# EasyEDA Pro project 2Axis-5.0-南塘 - (0522).eprj, schematic 2轴南塘

## Sheets
1 2轴南塘: Board Name: 2轴南塘; Create Date: 2025-03-24; Page Name: 2轴南塘; Project Name: 2Axis-5.0-南塘 - (0522); Schematic Name: 2轴南塘; Update Date: 2025-05-22; Address1: *; Address2: *; Address3: *; Address4: *; Application_BuildNumber: *; ApprovedBy: *; Author: *; CheckedBy: *; CompanyName: *; CurrentDate: *; CurrentTime: *; Date: *; DocumentFullPathAndName: *; DocumentName: *; DocumentNumber: *; DrawnBy: *; Engineer: *; ImagePath: *; ModifiedDate: *; Organization: *; ProjectName: *; Revision: *; Rule: *; SheetNumber: *; SheetTotal: *; Time: *; Title: *
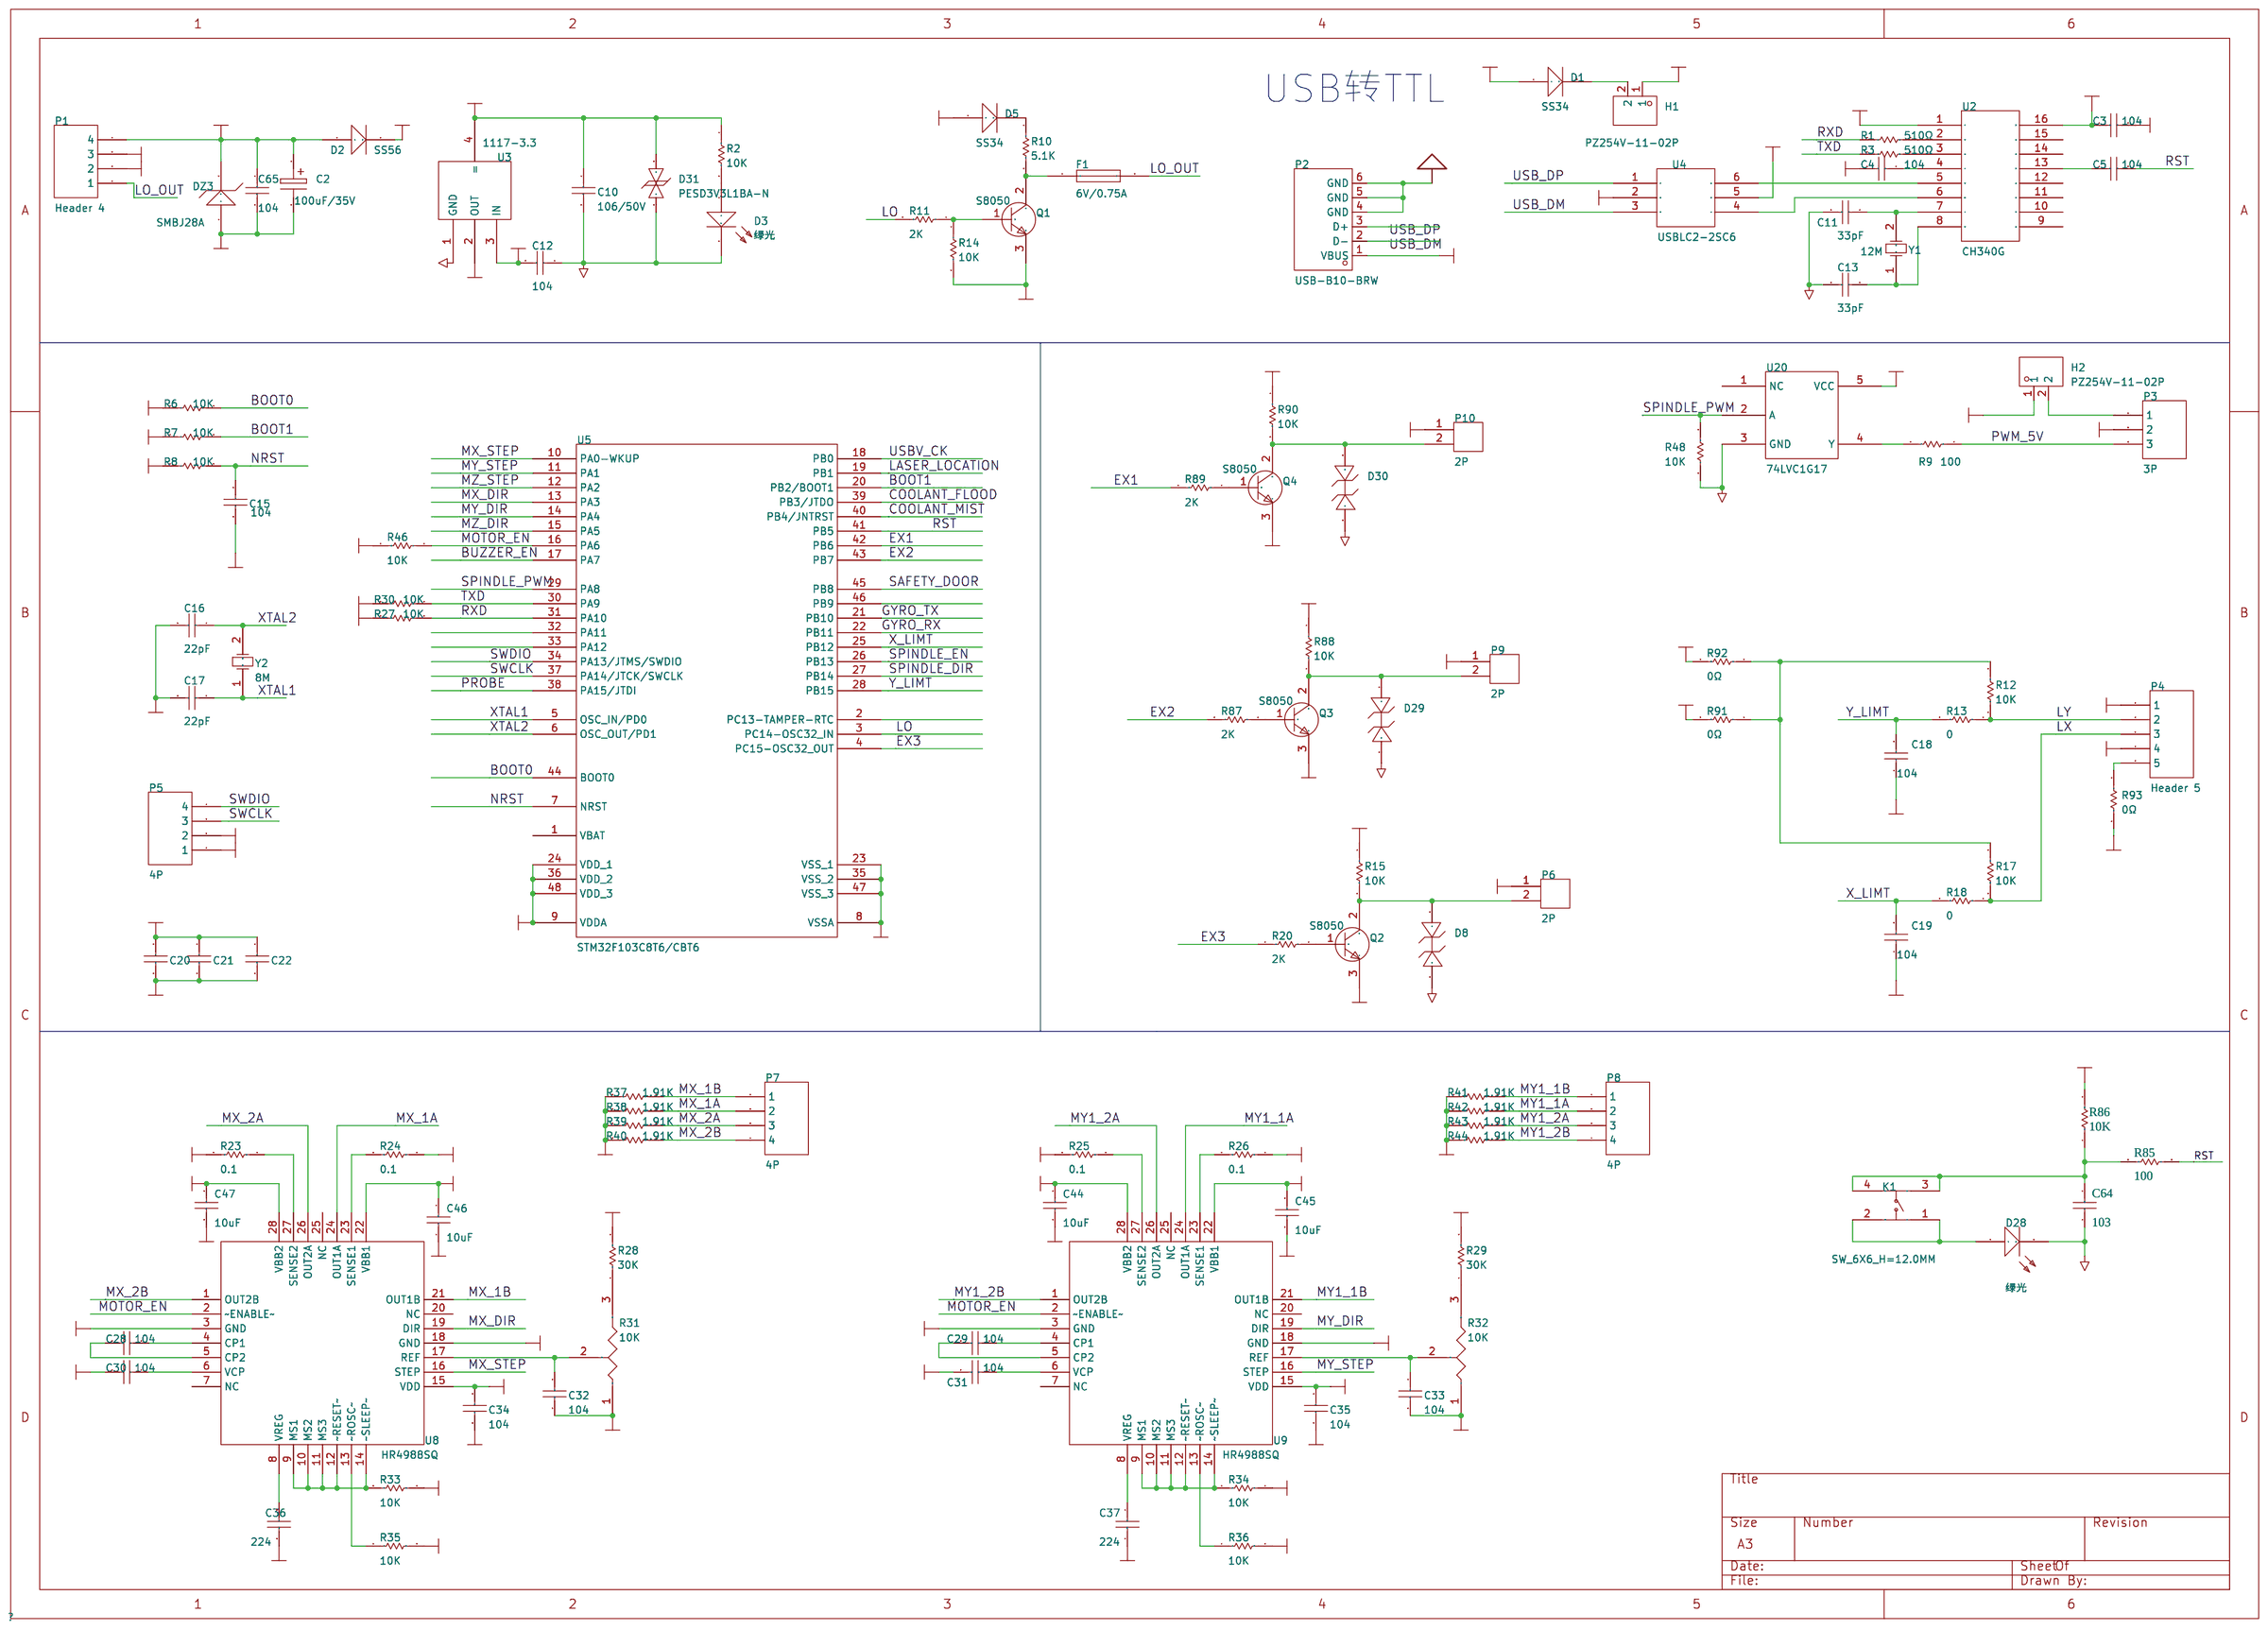
[diagram p0: 2轴南塘]
2 电源: Create Date: 2025-04-17; Page Name: 电源; Project Name: 2Axis-5.0-南塘; Update Date: 2025-05-21
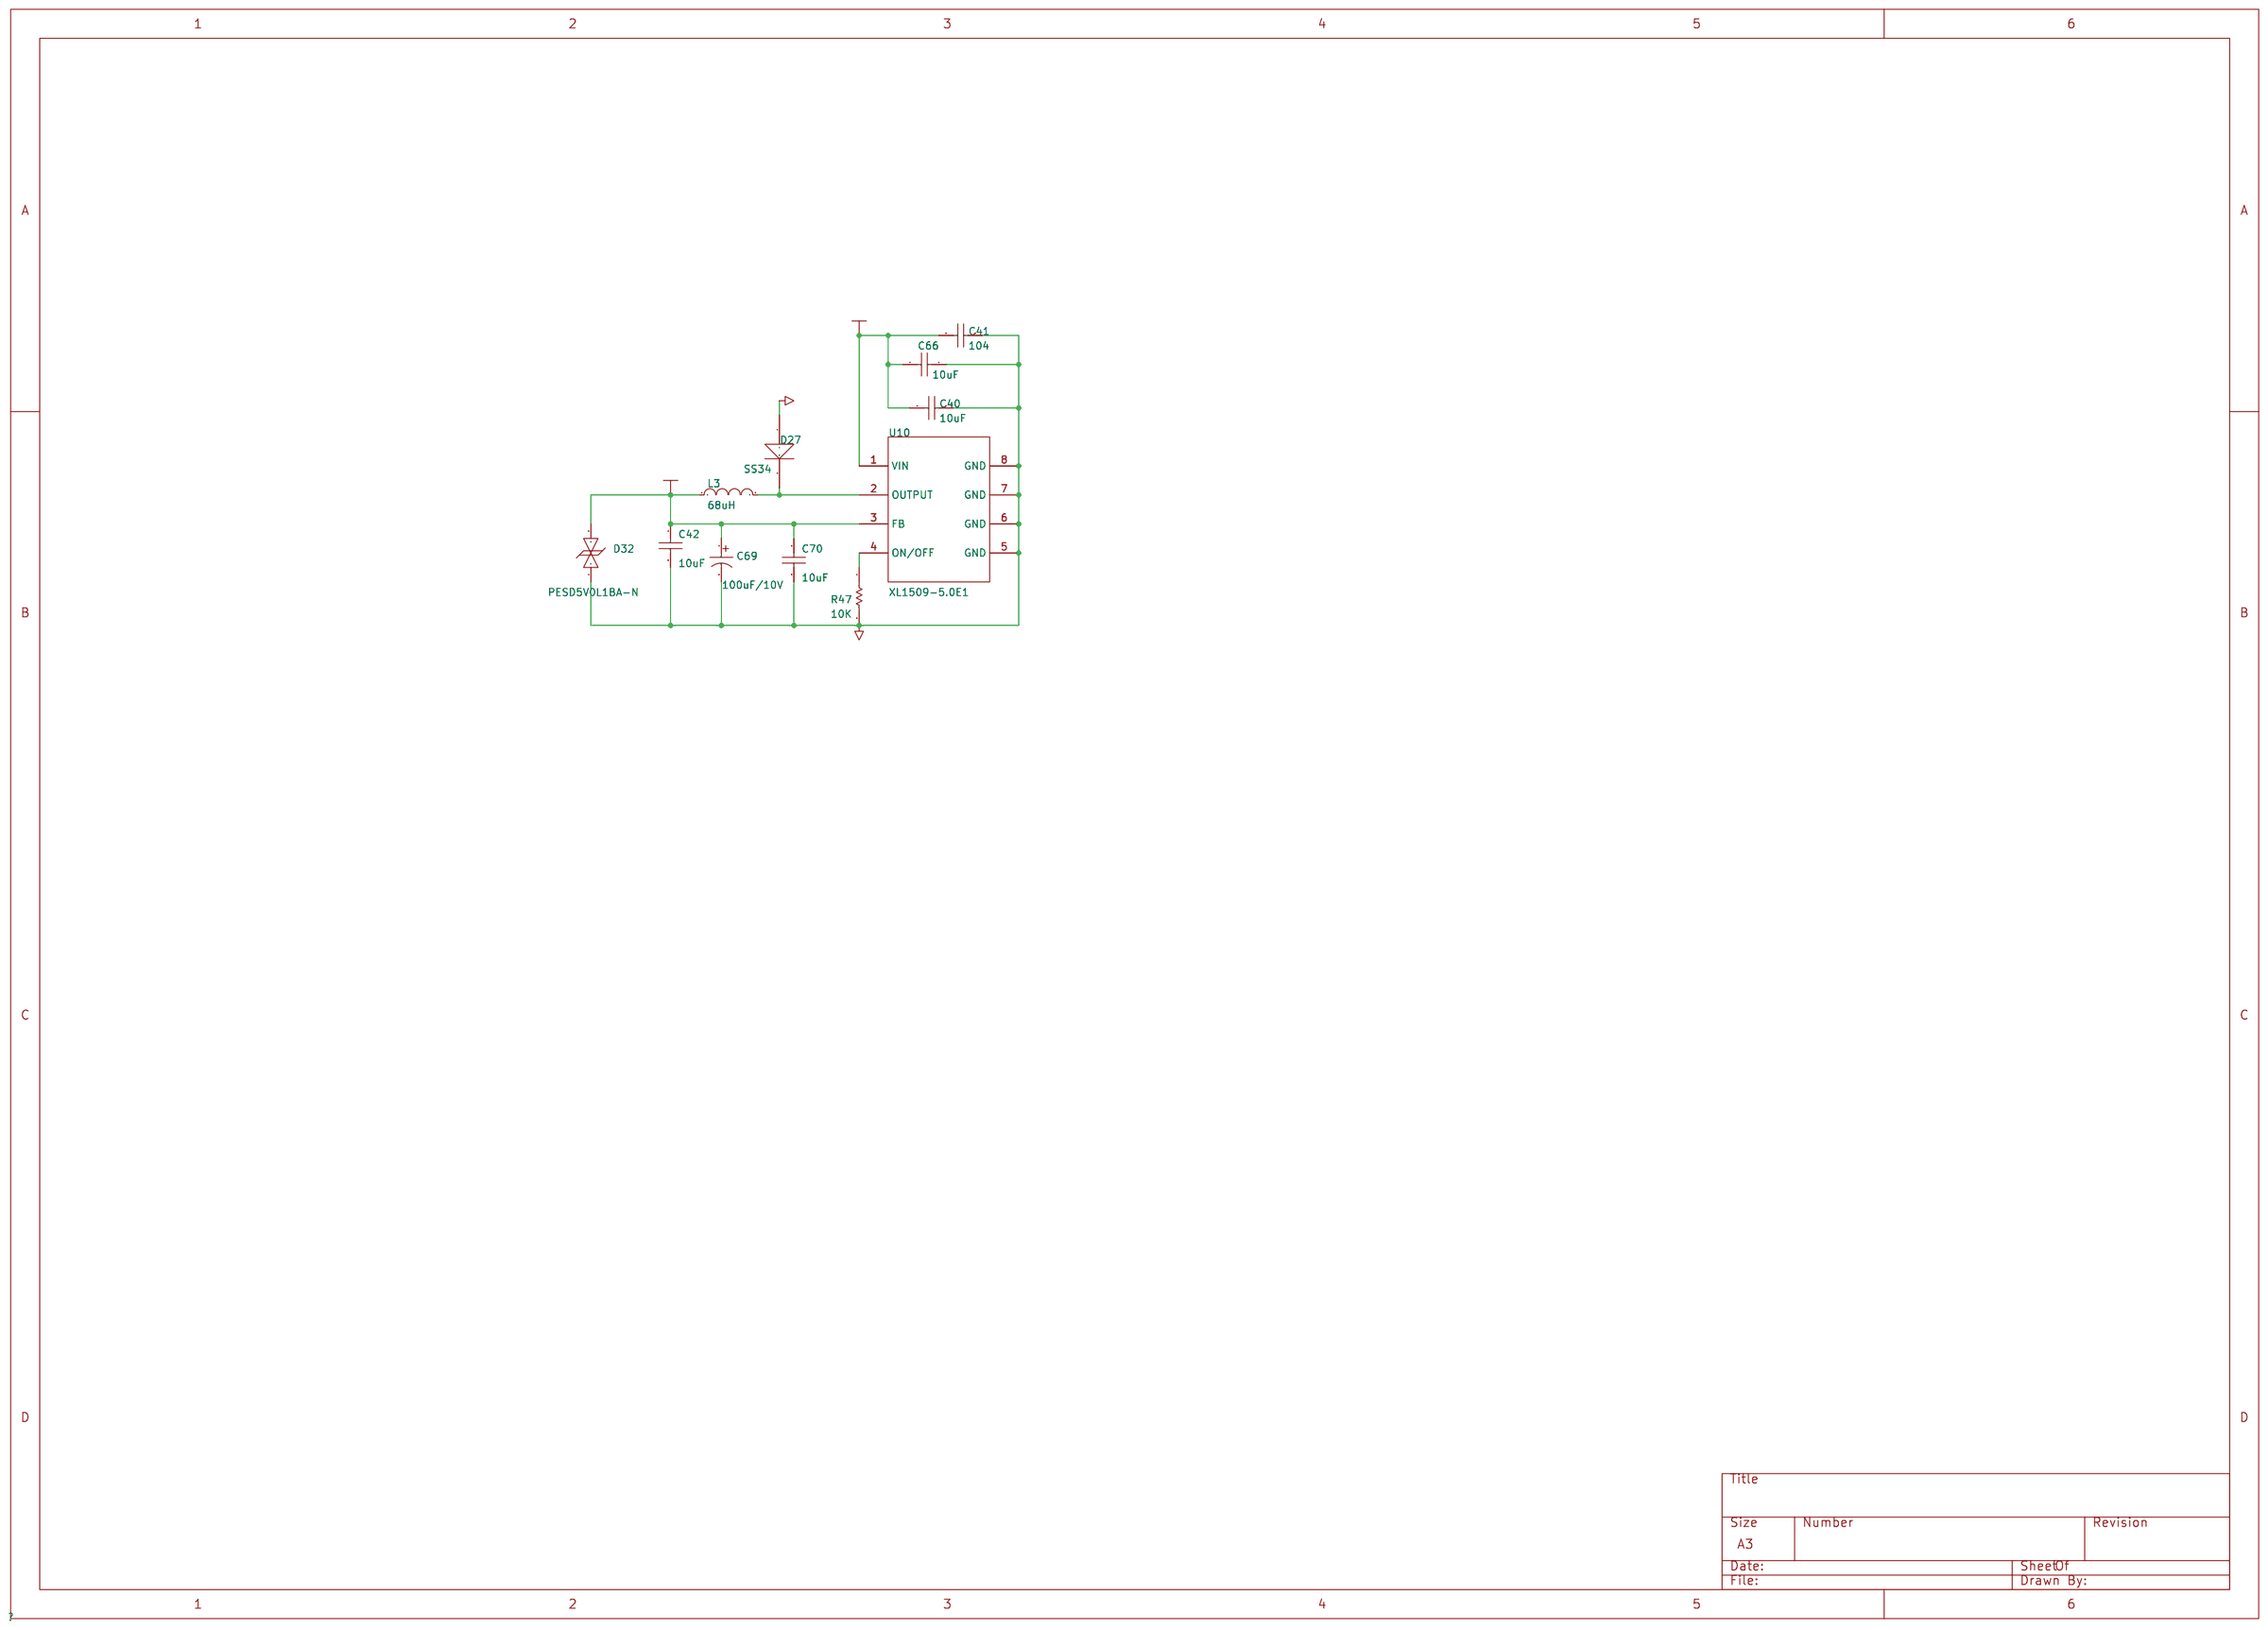
[diagram p1: 电源]

## Parts
sheet 2轴南塘
C2  100uF/35V  [电解电容贴片6X6]
C3  104  [0603C]
C4  104  [0603C]
C5  104  [0603C]
C10  106/50V  [1206C]
C11  18pF  [0603C]
C12  104  [0603C]
C13  18pF  [0603C]
C15  104  [0603C]
C16  100pF  [0603C]
C17  100pF  [0603C]
C18  104  [0603C]
C19  104  [0603C]
C20  104  [0603C]
C21  104  [0603C]
C22  104  [0603C]
C28  104  [0603C]
C29  104  [0603C]
C30  104  [0603C]
C31  104  [0603C]
C32  104  [0603C]
C33  104  [0603C]
C34  104  [0603C]
C35  104  [0603C]
C36  224  [0603C]
C37  224  [0603C]
C44  10uF  [C1206]
C45  10uF  [C1206]
C46  10uF  [C1206]
C47  10uF  [C1206]
C64  103  [0603C]
C65  104  [0603C]
D1  SS34  [SMA]
D2  SS56  [SMA]
D3  绿光  [0603LED]
D5  SS34  [SMA]
D8  ESD05V52D-C  [SOD-523_L1.2-W0.8-LS1.6-BI]
D28  绿光  [0603LED]
D29  ESD05V52D-C  [SOD-523_L1.2-W0.8-LS1.6-BI]
D30  ESD05V52D-C  [SOD-523_L1.2-W0.8-LS1.6-BI]
D31  PESD3V3L1BA-N  [SOD-323_L1.8-W1.3-LS2.5-BI]
DZ3  SMBJ28A  [SMB]
F1  6V/0.75A  [1206R]
H1  PZ254V-11-02P  [HDR-TH_2P-P2.54-V-M]
H2  PZ254V-11-02P  [HDR-TH_2P-P2.54-V-M]
K1  SW_6X6_H=12.0MM  [KEY-SMD_4P-L6.0-W6.0-P4.50-LS9.0]
P1  Header 4  [VH3.96-4P直插座]
P2  USB-B10-BRW  [USB-B-TH_USB-B10-BRW]
P3  3P  [HDR1X3_CON]
P4  Header 5  [HDR1X5_CON]
P5  4P  [SIP4]
P6  2P  [HDR1X2_CON]
P7  4P  [HDR1X4_CON]
P8  4P  [HDR1X4_CON]
P9  2P  [HDR1X2_CON]
P10  2P  [HDR1X2_CON]
Q1  S8050  [SOT-23]
Q2  S8050  [SOT-23]
Q3  S8050  [SOT-23]
Q4  S8050  [SOT-23]
R1  510Ω  [0603R]
R2  10K  [0603R]
R3  510Ω  [0603R]
R6  10K  [0603R]
R7  10K  [0603R]
R8  10K  [0603R]
R9  100  [0603R]
R10  5.1K  [0603R]
R11  2K  [0603R]
R12  10K  [0603R]
R13  0  [0603R]
R14  10K  [0603R]
R15  10K  [0603R]
R17  10K  [0603R]
R18  0  [0603R]
R20  2K  [0603R]
R23  0.1  [1206R]
R24  0.1  [1206R]
R25  0.1  [1206R]
R26  0.1  [1206R]
R27  10K  [0603R]
R28  10K  [0603R]
R29  10K  [0603R]
R30  10K  [0603R]
R31  10K  [松下贴片电位器3x3]
R32  10K  [松下贴片电位器3x3]
R33  10K  [0603R]
R34  10K  [0603R]
R35  10K  [0603R]
R36  10K  [0603R]
R37  1.91K  [1206R]
R38  1.91K  [1206R]
R39  1.91K  [1206R]
R40  1.91K  [1206R]
R41  1.91K  [1206R]
R42  1.91K  [1206R]
R43  1.91K  [1206R]
R44  1.91K  [1206R]
R46  10K  [0603R]
R48  10K  [0603R]
R85  100  [0603R]
R86  10K  [0603R]
R87  2K  [0603R]
R88  10K  [0603R]
R89  2K  [0603R]
R90  10K  [0603R]
R91  0Ω  [0603R]
R92  0Ω  [0603R]
R93  0Ω  [0603R]
U2  CH340G  [SOP16]
U3  1117-3.3  [SOT-223]
U4  USBLC2-2SC6  [SOT-23-6]
U5  STM32F103C8T6/CBT6  [LQFP48]
U8  HR4988SQ  [QFN28]
U9  HR4988SQ  [QFN28]
U20  74LVC1G17  [SOT-23-5]
Y1  12M  [晶振贴片49SSMD]
Y2  8M  [晶振贴片]
sheet 电源
C40  10uF  [C1206]
C41  104  [0603C]
C42  10uF  [C1206]
C66  10uF  [C1206]
C69  100uF/10V  [CAP-SMD_BD5.0-L5.3-W5.3-RD]
C70  10uF  [C1206]
D27  SS34  [SMA]
D32  PESD5V0L1BA-N  [SOD-323_L1.8-W1.3-LS2.5-BI]
L3  68uH  [IND-SMD_L7.0-W7.0_SMDRI74-330MT]
R47  10K  [0603R]
U10  XL1509-5.0E1  [ESOP-8_L4.9-W3.9-P1.27-LS6.0-BL-EP]

## Library data of the parts
C2 = 100uF/35V: Origin Footprint 2: X47U; Origin Footprint 1: 电解电容贴片6x6; Design Item ID: ELECTRO1; Library Name: *
C3-C5 C12 C15 C41 C65 = 104: Capacitor (Semiconductor SIM Model); Published: 8-Jun-2000; LatestRevisionDate: 17-Jul-2002; LatestRevisionNote: Re-released for DXP Platform.; PackageReference: C1206; Publisher: Altium Limited; Origin Footprint 2: C1206; Origin Footprint 3: 0402; Origin Footprint 4: 1310[0504]; Origin Footprint 5: 1608[0603]; Origin Footprint 6: C1210; Origin Footprint 7: C0805; Origin Footprint 8: C1206; Origin Footprint 9: 0805; Origin Footprint 10: 0805L; Origin Footprint 11: 0805C; Design Item ID: Cap Semi; Library Name: Miscellaneous Devices
C10 = 106/50V: Capacitor (Semiconductor SIM Model); Published: 8-Jun-2000; LatestRevisionDate: 17-Jul-2002; LatestRevisionNote: Re-released for DXP Platform.; PackageReference: C1206; Publisher: Altium Limited; Origin Footprint 2: C1206; Origin Footprint 3: 0402; Origin Footprint 4: 1310[0504]; Origin Footprint 5: 1608[0603]; Origin Footprint 6: C1210; Origin Footprint 7: C0805; Origin Footprint 8: C1206; Origin Footprint 9: 0805; Origin Footprint 10: 0805L; Design Item ID: Cap Semi; Library Name: Miscellaneous Devices
C11 C13 = 33pF: Capacitor (Semiconductor SIM Model); Published: 8-Jun-2000; LatestRevisionDate: 17-Jul-2002; LatestRevisionNote: Re-released for DXP Platform.; PackageReference: C1206; Publisher: Altium Limited; Origin Footprint 2: C1206; Origin Footprint 3: 0402; Origin Footprint 4: 1310[0504]; Origin Footprint 5: 1608[0603]; Origin Footprint 6: C1210; Origin Footprint 7: C0805; Origin Footprint 8: C1206; Origin Footprint 9: 0805; Origin Footprint 10: 0805L; Design Item ID: Cap Semi; Library Name: Miscellaneous Devices
C16 C17 = 22pF: Capacitor (Semiconductor SIM Model); Published: 8-Jun-2000; LatestRevisionDate: 17-Jul-2002; LatestRevisionNote: Re-released for DXP Platform.; PackageReference: C1206; Publisher: Altium Limited; Origin Footprint 2: C1206; Origin Footprint 3: 0402; Origin Footprint 4: 1310[0504]; Origin Footprint 5: 1608[0603]; Origin Footprint 6: C1210; Origin Footprint 7: C0805; Origin Footprint 8: C1206; Origin Footprint 9: 0805; Origin Footprint 10: 0805L; Origin Footprint 11: 0805C; Design Item ID: Cap Semi; Library Name: Miscellaneous Devices
C18-C22 C28-C35 = 104: Origin Footprint 2: CAP; Origin Footprint 3: 0805C; Design Item ID: CAP; Library Name: SCH封装库
C36 C37 = 224: Design Item ID: CAP; Library Name: SCH封装库
C40 C42 C44-C47 C66 C70 = 104: Design Item ID: CAP; Library Name: SCH--װ--
C64 = 103: Design Item ID: CAP; Library Name: SCH--װ--
D1 D2 D5 = SS56: Design Item ID: 1N4148; Library Name: SCH封装库
D3 D28 = 红光: Origin Footprint 2: LED(小); Design Item ID: LED; Library Name: SCH封装库
D8 D29 D30 = ESD05V52D-C: 极性：双向 反向截止电压(Vrwm)：5V 击穿电压(VBR)：5.6V 钳位电压(Vc)@Ipp：15V 反向截止电压(Vrwm)：5V 击穿电压(最小值)：5.6V 峰值脉冲电流(Ipp)@tp=8/20μs：5A 最大钳位电压：15V; Supplier Part: C727170; Manufacturer: TWGMC(台湾迪嘉); Supplier Footprint: SOD-523; JLCPCB Part Class: 扩展库; Datasheet: https://atta.szlcsc.com/upload/public/pdf/source/20200827/C727170_700AFDE065FF081A69A0C04747B3686A.pdf; Supplier: LCSC
D31 D32 = PESD5V0S1BBN: 极性:Bidirectional;反向关断电压（典型值）:5V (Max);击穿电压（最小值）:6V;箝位电压:15V;峰值脉冲电流（10/1000us）:5A (8/20us);; Supplier Part: C314264; Manufacturer: BORN伯恩半导体; Supplier Footprint: SOD-523; JLCPCB Part Class: Extended Part; Datasheet: https://atta.szlcsc.com/upload/public/pdf/source/20181015/C314264_F9AC5761AC2631DA841FBD1D9C6821E3.pdf; Supplier: LCSC; Polarity: Bidirectional; Voltage - Reverse Standoff (Typ): 5V (Max); Voltage - Breakdown (Min): 6V; Voltage - Clamping (Max) @ Ipp: 15V; Current - Peak Pulse (10/1000μs): 5A (8/20us)
DZ3 = SMBJ28A: Design Item ID: 稳压二极管; Library Name: SCH封装库
F1 = 6V/0.75A: 保险丝; Design Item ID: FUSE1; Library Name: SCH封装库
H1 H2 = PZ254V-11-02P: 插针结构:1x2P;间距:2.54mm;行距:-;圆针/方针:方针;安装类型:直插;排数:单排;总PIN位数:2P;额定电流:-;额定电压:-;配合针长度:6mm;塑高:2.5mm;端接针长度:3mm;触头材质:黄铜;触头镀层:-;工作温度范围:-40℃~+105℃;颜色:黑色;; LCSC Part Name: 间距:2.54mm 1x2P 直插 方针; Supplier Part: C492401; Manufacturer: XFCN(兴飞); Supplier Footprint: 插件,P=2.54mm; JLCPCB Part Class: 扩展库; Datasheet: https://atta.szlcsc.com/upload/public/pdf/source/20200309/C492401_A812433581A9B211A7FFA413ADDFF0E5.pdf; Supplier: LCSC; Pin Structure: 1x2P; Pitch: 2.54mm; Circluar Pins/Square Pins: 方针; Mounting Type: 直插; Number of Rows: 单排; Number of Pins: 2P; Length of Mating Pin: 6mm; Insulation Height: 2.5mm; Length of End Connection Pin: 3mm; Contact Material: 黄铜; Operating Temperature Range: -40℃~+105℃; Color: 黑色
K1 = SW_6X6_H=12.0MM: Supplier Part: C9900018802; Supplier Footprint: KEY-SMD; JLCPCB Part Class: 扩展库; Supplier: LCSC
P1 = Header 4: Header, 4-Pin; LatestRevisionDate: 17-Jul-2002; LatestRevisionNote: Re-released for DXP Platform.; Publisher: Altium Limited; Library Name: Miscellaneous Connectors
P2 = USB-B10-BRW: 连接器类型:Type-B;标准:USB 2.0;公母:母;端口数量:1;触点数量:4P;安装方式:弯插;额定电流 - 电源:1.5A;工作温度范围:-20℃~+70℃;焊接温度(最大值):260℃;; LCSC Part Name: Type-B母弯插; Supplier Part: C720549; Manufacturer: XUNPU(讯普); Supplier Footprint: 插件; JLCPCB Part Class: 扩展库; Datasheet: https://atta.szlcsc.com/upload/public/pdf/source/20200812/C720549_53E9294752E2933874870440E626C579.pdf; Supplier: LCSC; Connector Type: Type-B; Standard: USB2.0; Gender: 母; Number of Ports: 1; Number of Contacts: 4P; Mounting Style: 弯插; Current Rating - Power (Max): 1.5A; Operating Temperature Range: -20℃~+70℃; Soldering Temperature(Max): 260℃
P3 = 3P: Library Name: SCH封装库
P4 = Header 5: Header, 5-Pin; LatestRevisionDate: 17-Jul-2002; LatestRevisionNote: Re-released for DXP Platform.; Publisher: Altium Limited; Library Name: Miscellaneous Connectors
P5 P7 P8 = 4P: Library Name: SCH封装库
P6 P9 P10 = 2P: Library Name: SCH封装库
Q1-Q4 = S8050: Published: 8-Jun-2000; LatestRevisionDate: 17-Jul-2002; LatestRevisionNote: Re-released for DXP Platform.; PackageReference: TO-226; Publisher: Altium Limited; Code_JEDEC: TO-226-AA; Origin Footprint 2: TO-92; Design Item ID: NPN; Library Name: SCH封装库
R1 R3 R9 R15 R88 R90 = 100: Resistor; Published: 8-Jun-2000; LatestRevisionDate: 17-Jul-2002; LatestRevisionNote: Re-released for DXP Platform.; PackageReference: AXIAL-0.3; Publisher: Altium Limited; Origin Footprint 2: AXIAL-0.3; Origin Footprint 3: R0805; Origin Footprint 4: 0805R; Design Item ID: RES; Library Name: SCH封装库
R2 R10 R11 R13 R18 R20 R87 R89 R91-R93 = 2K: Resistor; Published: 8-Jun-2000; LatestRevisionDate: 17-Jul-2002; LatestRevisionNote: Re-released for DXP Platform.; PackageReference: AXIAL-0.3; Publisher: Altium Limited; Origin Footprint 2: AXIAL-0.3; Origin Footprint 3: R0805; Origin Footprint 4: 0805R; Design Item ID: RES; Library Name: SCH封装库
R6-R8 R27 R30 = 10k: Resistor; Published: 8-Jun-2000; LatestRevisionDate: 17-Jul-2002; LatestRevisionNote: Re-released for DXP Platform.; PackageReference: AXIAL-0.3; Publisher: Altium Limited; Origin Footprint 2: AXIAL-0.3; Origin Footprint 3: 0805R; Origin Footprint 4: 0805R; Design Item ID: RES; Library Name: SCH封装库
R12 R14 R17 R28 R29 R33 R34 R46 R47 = 10k: Resistor; Published: 8-Jun-2000; LatestRevisionDate: 17-Jul-2002; LatestRevisionNote: Re-released for DXP Platform.; PackageReference: AXIAL-0.3; Publisher: Altium Limited; Origin Footprint 2: AXIAL-0.3; Origin Footprint 3: R0805; Origin Footprint 4: 0805R; Design Item ID: RES; Library Name: SCH封装库
R23-R26 = 0.1: Resistor; Published: 8-Jun-2000; LatestRevisionDate: 17-Jul-2002; LatestRevisionNote: Re-released for DXP Platform.; PackageReference: AXIAL-0.3; Publisher: Altium Limited; Origin Footprint 2: AXIAL-0.3; Origin Footprint 3: R0805; Origin Footprint 4: 0603R; Design Item ID: RES; Library Name: SCH封装库
R31 R32 = 10K: Design Item ID: 电位器; Library Name: SCH封装库
R35 R36 = 10k: Resistor; Published: 8-Jun-2000; LatestRevisionDate: 17-Jul-2002; LatestRevisionNote: Re-released for DXP Platform.; PackageReference: AXIAL-0.3; Publisher: Altium Limited; Origin Footprint 2: AXIAL-0.3; Origin Footprint 3: R0805; Design Item ID: RES; Library Name: SCH封装库
R37-R44 = 1.91K: Resistor; Published: 8-Jun-2000; LatestRevisionDate: 17-Jul-2002; LatestRevisionNote: Re-released for DXP Platform.; PackageReference: AXIAL-0.3; Publisher: Altium Limited; Origin Footprint 2: AXIAL-0.3; Origin Footprint 3: R0805; Origin Footprint 4: 0805R; Design Item ID: RES; Library Name: SCH封装库
R48 R86 = 10K: Resistor; Published: 8-Jun-2000; LatestRevisionDate: 17-Jul-2002; LatestRevisionNote: Re-released for DXP Platform.; PackageReference: AXIAL-0.3; Publisher: Altium Limited; Origin Footprint 2: AXIAL-0.3; Origin Footprint 3: R0805; Origin Footprint 4: 0805R; Design Item ID: RES; Library Name: SCH--װ--
R85 = 100: Resistor; Published: 8-Jun-2000; LatestRevisionDate: 17-Jul-2002; LatestRevisionNote: Re-released for DXP Platform.; PackageReference: AXIAL-0.3; Publisher: Altium Limited; Origin Footprint 2: AXIAL-0.3; Origin Footprint 3: R0805; Origin Footprint 4: 0805R; Design Item ID: RES; Library Name: SCH--װ--
U2 = CH340G: Design Item ID: DIP16; Library Name: SCH封装库
U3 = 1117-3.3: Design Item ID: LM1117; Library Name: Party600
U4 = USBLC2-2SC6: Design Item ID: DIP6; Library Name: SCH封装库
U5 = STM32F103C8T6/CBT6: STM32 ARM-based 32-bit MCU with 32 Kbytes Flash, 48-pin LQFP, Industrial Temperature; Published: *; DatasheetVersion: *; PackageVersion: *; PackageReference: *; Publisher: *; PackageDescription: *; ComponentLink1Description: *; ComponentLink1URL: *; ComponentLink2Description: *; ComponentLink2URL: *; Origin Footprint 2: LQFP48_L; Origin Footprint 3: LQFP48_M; Design Item ID: STM32F103C6T6; Library Name: ST Microcontroller 32-Bit STM32 SCH
U8 U9 = HR4988SQ: Design Item ID: HR4988; Library Name: SCH封装库
U20 = 74LVC1G04: Library Name: SCH--װ--
Y1 = 12M: Crystal Oscillator; Published: 8-Jun-2000; LatestRevisionDate: 17-Jul-2002; LatestRevisionNote: Re-released for DXP Platform.; PackageReference: R38; Publisher: Altium Limited; Origin Footprint 2: R38; Origin Footprint 3: XTAL-49S; Design Item ID: XTAL; Library Name: Miscellaneous Devices
Y2 = 8M: Crystal Oscillator; Published: 8-Jun-2000; LatestRevisionDate: 17-Jul-2002; LatestRevisionNote: Re-released for DXP Platform.; PackageReference: R38; Publisher: Altium Limited; Origin Footprint 2: R38; Origin Footprint 3: XTAL-49S; Design Item ID: XTAL; Library Name: Miscellaneous Devices
C69 = CS1A101M-CRD54: LCSC Part Name: 100uF ±20% 10V; Supplier Part: C96182; Manufacturer: ST(先科); Supplier Footprint: SMD,5x5.4mm; JLCPCB Part Class: Extended Part; Datasheet: https://atta.szlcsc.com/upload/public/pdf/source/20170304/1488621207726.pdf; Supplier: LCSC; Tolerance: ±20%; Rated Voltage: 10V; φD: 5mm; L: 5.4mm; Lifetime @ Temp: 1000hrs@105℃; Operating Temperature: -40℃~+105℃
D27 = SS56: Design Item ID: 1N4148; Library Name: SCH--װ--
L3 = SMDRI74-330MT: 电感值:33uH;精度:±20%;额定电流:960mA;饱和电流(Isat):1.8A;类型:屏蔽电感;; LCSC Part Name: 33uH±20%1.8A; Supplier Part: C49625; Manufacturer: SXN(顺翔诺); Supplier Footprint: SMD,7.5x7.5mm; JLCPCB Part Class: 扩展库; Datasheet: https://atta.szlcsc.com/upload/public/pdf/source/20210810/6F96FDC19AA308DD2AD166FFB9640E87.pdf; Supplier: LCSC; Tolerance: ±20%; Rated Current: 960mA; Saturation Current (Isat): 1.8A; DC Resistance (DCR): 170mΩ; Type: 屏蔽电感
U10 = XL1509-5.0E1: LCSC Part Name: 降压型; Supplier Part: C61063; Manufacturer: XLSEMI(芯龙); Supplier Footprint: SOP-8_150mil; JLCPCB Part Class: Basic Part; Datasheet: https://atta.szlcsc.com/upload/public/pdf/source/20151020/1457707483545.pdf; Supplier: LCSC; Function: 降压型

## Nets
3V3: C10.1 C20.2 C21.2 C22.2 D31.2 P5.2 R2.1 R8.1 R27.1 R30.1 R46.2 R86.2 R92.2 U3.2(OUT) U3.4(=) U5.9(VDDA) U5.24(VDD_1) U5.36(VDD_2) U5.48(VDD_3)
5VV: P1.2
24V: C40.2 C41.2 C66.1 D2.2 H2.1 U10.1(VIN)
GND: C2.2 C3.2 C4.2 C10.2 C11.2 C12.1 C13.2 C15.1 C16.2 C17.2 C18.1 C19.1 C20.1 C21.1 C22.1 C32.2 C33.2 C34.2 C35.2 C36.2 C37.2 C40.1 C41.1 C42.2 C44.2 C45.2 C46.2 C47.2 C64.1 C65.2 C66.2 C69.2 C70.2 D3.2 D8.1 D27.1 D28.2 D29.1 D30.1 D31.1 D32.1 DZ3.1 P1.3 P2.4(GND) P2.5(GND) P2.6(GND) P3.2 P4.1 P4.4 P5.1 P6.1 P9.1 P10.1 Q1.3(E) Q2.3(E) Q3.3(E) Q4.3(E) R6.1 R7.1 R14.2 R23.2 R24.1 R25.2 R26.1 R31.1(A) R32.1(A) R35.2 R36.2 R37.2 R38.2 R39.2 R40.2 R41.2 R42.2 R43.2 R44.2 R47.2 R48.2 U2.1 U3.1(GND) U4.2 U5.8(VSSA) U5.23(VSS_1) U5.35(VSS_2) U5.47(VSS_3) U8.3(GND) U8.18(GND) U9.3(GND) U9.18(GND) U10.5(GND) U10.6(GND) U10.7(GND) U10.8(GND) U20.3(GND)
VCC: C3.1 C12.2 C34.1 C35.1 C42.1 C69.1 C70.1 D5.1 D32.2 H1.1 L3.1 R15.1 R28.2 R29.2 R33.1 R34.1 R88.1 R90.1 R91.2 R93.2 U2.16 U3.3(IN) U8.15(VDD) U9.15(VDD) U10.3(FB) U20.5(VCC)
BOOT0: R6.2 U5.44(BOOT0)
BOOT1: R7.2 U5.20(PB2/BOOT1)
BUZZER_EN: U5.17(PA7)
COOLANT_FLOOD: U5.39(PB3/JTDO)
COOLANT_MIST: U5.40(PB4/JNTRST)
EX1: R89.2 U5.42(PB6)
EX2: R87.2 U5.43(PB7)
EX3: R20.2 U5.4(PC15-OSC32_OUT)
GYRO_RX: U5.22(PB11)
GYRO_TX: U5.21(PB10)
LASER_LOCATION: U5.19(PB1)
LO: R11.2 U5.3(PC14-OSC32_IN)
LO_OUT: F1.2 P1.1
LX: P4.3 R17.2 R18.1
LY: P4.2 R12.1 R13.1
MOTOR_EN: R46.1 U5.16(PA6) U8.2(~ENABLE~) U9.2(~ENABLE~)
MX_1A: P7.2 R38.1 U8.24(OUT1A)
MX_1B: P7.1 R37.1 U8.21(OUT1B)
MX_2A: P7.3 R39.1 U8.26(OUT2A)
MX_2B: P7.4 R40.1 U8.1(OUT2B)
MX_DIR: U5.13(PA3) U8.19(DIR)
MX_STEP: U5.10(PA0-WKUP) U8.16(STEP)
MY1_1A: P8.2 R42.1 U9.24(OUT1A)
MY1_1B: P8.1 R41.1 U9.21(OUT1B)
MY1_2A: P8.3 R43.1 U9.26(OUT2A)
MY1_2B: P8.4 R44.1 U9.1(OUT2B)
MY_DIR: U5.14(PA4) U9.19(DIR)
MY_STEP: U5.11(PA1) U9.16(STEP)
MZ_DIR: U5.15(PA5)
MZ_STEP: U5.12(PA2)
NRST: C15.2 R8.2 U5.7(NRST)
PROBE: U5.38(PA15/JTDI)
PWM_5V: P3.3 R9.1
RST: C5.2 R85.1 U5.41(PB5)
RXD: R1.2 R27.2 U5.31(PA10)
SAFETY_DOOR: U5.45(PB8)
SPINDLE_DIR: U5.27(PB14)
SPINDLE_EN: U5.26(PB13)
SPINDLE_PWM: R48.1 U5.29(PA8) U20.2(A)
SWCLK: P5.3 U5.37(PA14/JTCK/SWCLK)
SWDIO: P5.4 U5.34(PA13/JTMS/SWDIO)
TXD: R3.2 R30.2 U5.30(PA9)
USB_DM: P2.2(D-) U4.3
USB_DP: P2.3(D+) U4.1
USBV_CK: U5.18(PB0)
VM: C2.1 C30.2 C31.2 C44.1 C45.1 C46.1 C47.1 C65.1 D2.1 DZ3.2 P1.4 U8.22(VBB1) U8.28(VBB2) U9.22(VBB1) U9.28(VBB2)
VUSB: D1.1 P2.1(VBUS) U4.5
X_LIMT: C19.2 R18.2 U5.25(PB12)
XTAL1: C17.1 U5.5(OSC_IN/PD0) Y2.1(OSC1)
XTAL2: C16.1 U5.6(OSC_OUT/PD1) Y2.2(OSC2)
Y_LIMT: C18.2 R13.2 U5.28(PB15)
$1N59: C28.2 U8.5(CP2)
$1N60: C28.1 U8.4(CP1)
$1N61: C30.1 U8.6(VCP)
$1N63: C36.1 U8.8(VREG)
$1N64: R35.1 U8.13(~ROSC~)
$1N66: C32.1 R31.2(TAP) U8.17(REF)
$1N71: R24.2 U8.23(SENSE1)
$1N75: R23.1 U8.27(SENSE2)
$1N80: C29.2 U9.5(CP2)
$1N81: C29.1 U9.4(CP1)
$1N82: C31.1 U9.6(VCP)
$1N84: C37.1 U9.8(VREG)
$1N85: R36.1 U9.13(~ROSC~)
$1N88: C33.1 R32.2(TAP) U9.17(REF)
$1N93: R26.2 U9.23(SENSE1)
$1N97: R25.1 U9.27(SENSE2)
$1N115: R33.2 U8.9(MS1) U8.10(MS2) U8.11(MS3) U8.12(~RESET~) U8.14(~SLEEP~)
$1N116: R34.2 U9.9(MS1) U9.10(MS2) U9.11(MS3) U9.12(~RESET~) U9.14(~SLEEP~)
$1N125: C4.1 U2.4
$1N128: C5.1 U2.13
$1N132: U2.5 U4.6
$1N135: U2.6 U4.4
$1N136: C11.1 U2.7 Y1.2(OSC2)
$1N137: C13.1 U2.8 Y1.1(OSC1)
$1N138: R9.2 U20.4(Y)
$1N142: F1.1 Q1.2(C) R10.2
$1N144: D8.2 P6.2 Q2.2(C) R15.2
$1N164: R12.2 R17.1 R91.1 R92.1
$1N165: Q1.1(B) R11.1 R14.1
$1N2613: D3.1 R2.2
$1N2624: R28.1 R31.3(B)
$1N2639: R29.1 R32.3(B)
$1N2662: R1.1 U2.2
$1N2663: R3.1 U2.3
$1N2693: Q2.1(B) R20.1
$1N9328: D1.2 H1.2
$1N9382: H2.2 P3.1
$1N9395: P4.5 R93.1
$1N11867: C64.2 K1.3 K1.4 R85.2 R86.1
$1N11898: D28.1 K1.1 K1.2
$1N12391: D29.2 P9.2 Q3.2(C) R88.2
$1N12399: Q3.1(B) R87.1
$1N12595: D30.2 P10.2 Q4.2(C) R90.2
$1N12603: Q4.1(B) R89.1
$1N12641: D5.2 R10.1
$3N13716: D27.2 L3.2 U10.2(OUTPUT)
$3N13784: R47.1 U10.4(ON/OFF)

Not connected (* = marked no-connect by the designer): U2 9 10 11 12 14 15; U5 1(VBAT) 2(PC13-TAMPER-RTC) 32(PA11) 33(PA12) 46(PB9); U8 7(NC) 20(NC) 25(NC); U9 7(NC) 20(NC) 25(NC); U20 1(NC)

## Notes on the sheets
sheet 1
- USB转TTL
